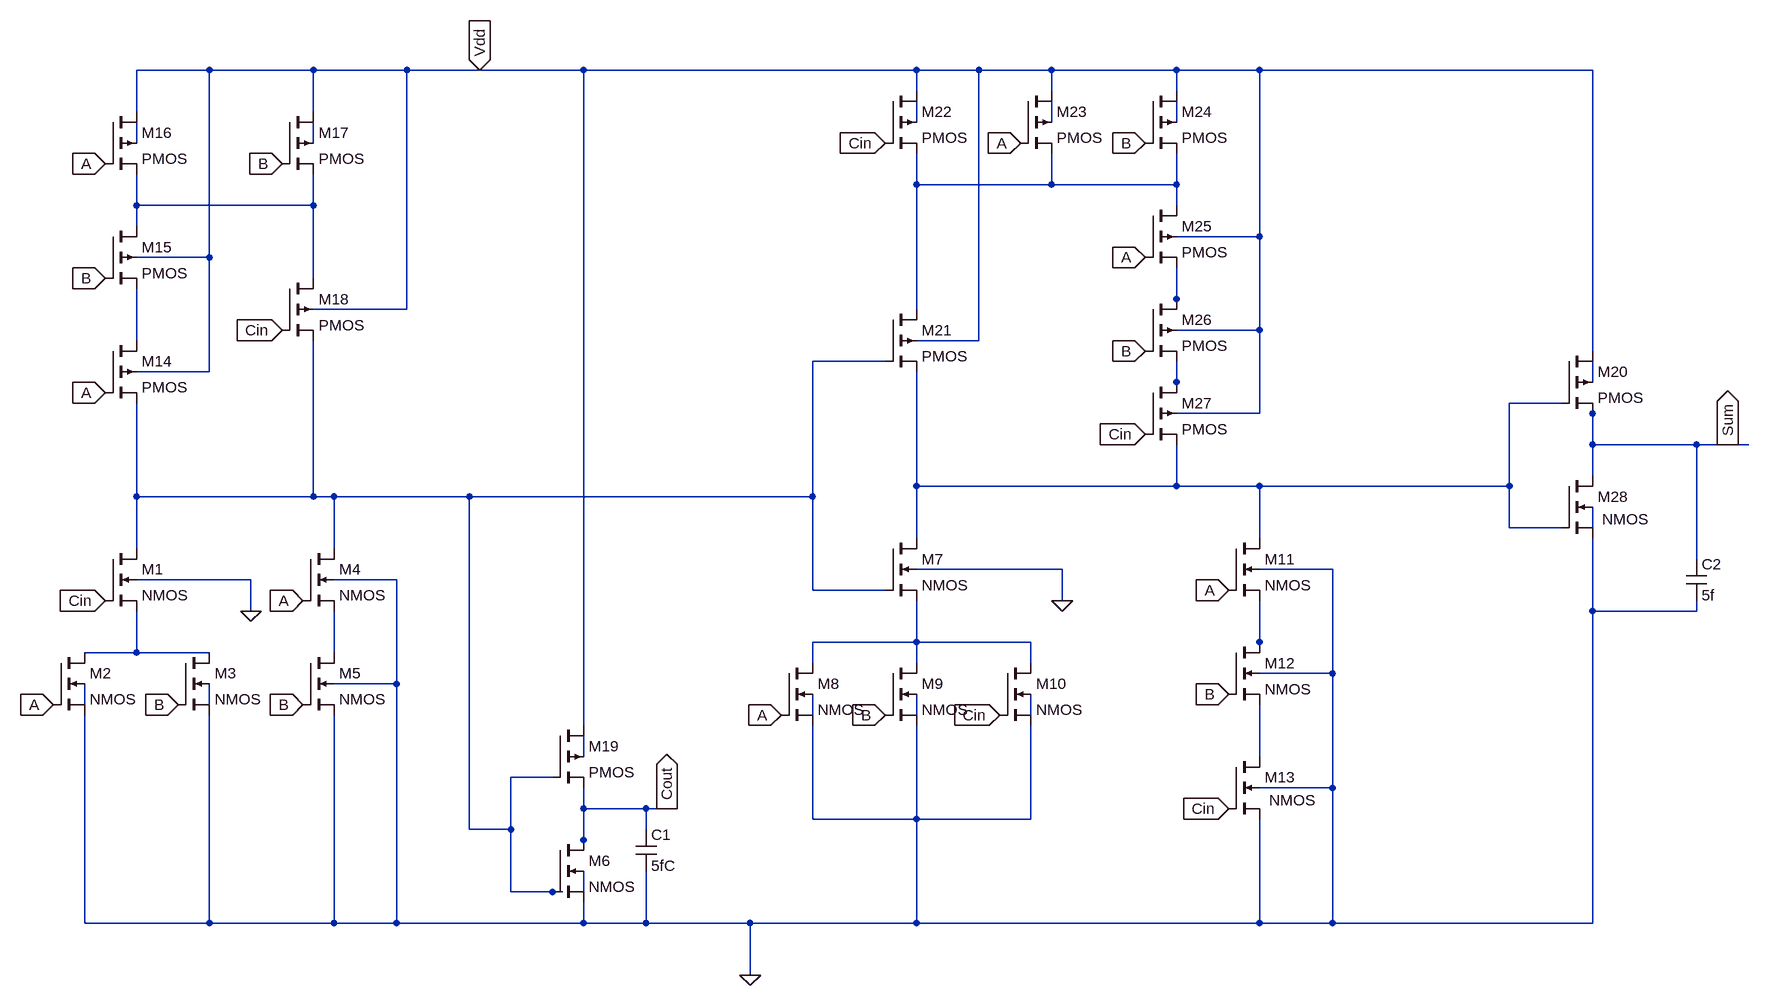
[diagram p0: schematic fa.asc]
fa.asc, the LTspice schematic file:
Version 4.1
SHEET 1 1716 820
WIRE -704 -592 -816 -592
WIRE -544 -592 -704 -592
WIRE -400 -592 -544 -592
WIRE -288 -592 -400 -592
WIRE -128 -592 -288 -592
WIRE 384 -592 -128 -592
WIRE 480 -592 384 -592
WIRE 592 -592 480 -592
WIRE 784 -592 592 -592
WIRE 912 -592 784 -592
WIRE 1424 -592 912 -592
WIRE 384 -560 384 -592
WIRE 592 -560 592 -592
WIRE 784 -560 784 -592
WIRE -816 -528 -816 -592
WIRE -544 -528 -544 -592
WIRE 384 -512 384 -544
WIRE 592 -512 592 -544
WIRE 784 -512 784 -544
WIRE -816 -480 -816 -512
WIRE -544 -480 -544 -512
WIRE 384 -416 384 -464
WIRE 592 -416 592 -464
WIRE 592 -416 384 -416
WIRE 784 -416 784 -464
WIRE 784 -416 592 -416
WIRE -816 -384 -816 -432
WIRE -544 -384 -544 -432
WIRE -544 -384 -816 -384
WIRE 784 -384 784 -416
WIRE -816 -352 -816 -384
WIRE 912 -336 912 -592
WIRE 912 -336 784 -336
WIRE -704 -304 -704 -592
WIRE -704 -304 -816 -304
WIRE -544 -272 -544 -384
WIRE 784 -240 784 -288
WIRE -400 -224 -400 -592
WIRE -400 -224 -544 -224
WIRE 384 -224 384 -416
WIRE 784 -224 784 -240
WIRE 912 -192 912 -336
WIRE 912 -192 784 -192
WIRE -816 -176 -816 -256
WIRE 480 -176 480 -592
WIRE 480 -176 384 -176
WIRE 1424 -160 1424 -592
WIRE 336 -144 224 -144
WIRE -704 -128 -704 -304
WIRE -704 -128 -816 -128
WIRE 784 -112 784 -144
WIRE 1424 -112 1424 -144
WIRE 784 -96 784 -112
WIRE 1376 -80 1296 -80
WIRE 912 -64 912 -192
WIRE 912 -64 784 -64
WIRE 1424 -64 1424 -80
WIRE 1424 -16 1424 -64
WIRE 1584 -16 1424 -16
WIRE 1632 -16 1584 -16
WIRE 1664 -16 1632 -16
WIRE 1424 32 1424 -16
WIRE 384 48 384 -128
WIRE 784 48 784 -16
WIRE 784 48 384 48
WIRE 912 48 784 48
WIRE 1296 48 1296 -80
WIRE 1296 48 912 48
WIRE -816 64 -816 -80
WIRE -544 64 -544 -176
WIRE -544 64 -816 64
WIRE -512 64 -544 64
WIRE -304 64 -512 64
WIRE 224 64 224 -144
WIRE 224 64 -304 64
WIRE 1296 112 1296 48
WIRE 1376 112 1296 112
WIRE 1424 112 1424 80
WIRE 384 128 384 48
WIRE 912 128 912 48
WIRE -816 144 -816 64
WIRE -512 144 -512 64
WIRE 1584 160 1584 -16
WIRE 608 176 384 176
WIRE 1024 176 912 176
WIRE -640 192 -816 192
WIRE -416 192 -512 192
WIRE 224 208 224 64
WIRE 336 208 224 208
WIRE 608 224 608 176
WIRE -640 240 -640 192
WIRE 1424 240 1424 128
WIRE 1584 240 1584 224
WIRE 1584 240 1424 240
WIRE 384 288 384 224
WIRE 384 288 224 288
WIRE 560 288 384 288
WIRE 912 288 912 224
WIRE -816 304 -816 240
WIRE -816 304 -896 304
WIRE -704 304 -816 304
WIRE -512 304 -512 240
WIRE 912 304 912 288
WIRE 224 320 224 288
WIRE 384 320 384 288
WIRE 560 320 560 288
WIRE 1024 336 1024 176
WIRE 1024 336 912 336
WIRE -416 352 -416 192
WIRE -416 352 -512 352
WIRE -896 384 -896 352
WIRE -704 384 -704 352
WIRE 224 400 224 368
WIRE 384 400 384 368
WIRE 560 400 560 368
WIRE -128 416 -128 -592
WIRE -128 464 -128 432
WIRE 912 464 912 384
WIRE -176 496 -240 496
WIRE 1024 512 1024 336
WIRE 1024 512 912 512
WIRE -128 544 -128 512
WIRE -32 544 -128 544
WIRE 0 544 -32 544
WIRE 16 544 0 544
WIRE 224 560 224 416
WIRE 384 560 384 416
WIRE 384 560 224 560
WIRE 560 560 560 416
WIRE 560 560 384 560
WIRE -304 576 -304 64
WIRE -240 576 -240 496
WIRE -240 576 -304 576
WIRE -32 576 -32 544
WIRE -128 592 -128 544
WIRE -128 608 -128 592
WIRE -240 672 -240 576
WIRE -176 672 -240 672
WIRE -160 672 -176 672
WIRE -128 672 -128 640
WIRE -896 720 -896 400
WIRE -704 720 -704 400
WIRE -704 720 -896 720
WIRE -512 720 -512 400
WIRE -512 720 -704 720
WIRE -416 720 -416 352
WIRE -416 720 -512 720
WIRE -128 720 -128 688
WIRE -128 720 -416 720
WIRE -32 720 -32 640
WIRE -32 720 -128 720
WIRE 128 720 -32 720
WIRE 384 720 384 560
WIRE 384 720 128 720
WIRE 912 720 912 560
WIRE 912 720 384 720
WIRE 1024 720 1024 512
WIRE 1024 720 912 720
WIRE 1424 720 1424 240
WIRE 1424 720 1024 720
WIRE 128 800 128 720
FLAG -864 224 Cin
IOPIN -864 224 In
FLAG -592 -192 Cin
IOPIN -592 -192 In
FLAG 512 400 Cin
IOPIN 512 400 In
FLAG 336 -480 Cin
IOPIN 336 -480 In
FLAG 736 -32 Cin
IOPIN 736 -32 In
FLAG 864 544 Cin
IOPIN 864 544 In
FLAG -944 384 A
IOPIN -944 384 In
FLAG -864 -448 A
IOPIN -864 -448 In
FLAG -864 -96 A
IOPIN -864 -96 In
FLAG -560 224 A
IOPIN -560 224 In
FLAG 176 400 A
IOPIN 176 400 In
FLAG 864 208 A
IOPIN 864 208 In
FLAG 736 -304 A
IOPIN 736 -304 In
FLAG 544 -480 A
IOPIN 544 -480 In
FLAG -592 -448 B
IOPIN -592 -448 In
FLAG -864 -272 B
IOPIN -864 -272 In
FLAG -752 384 B
IOPIN -752 384 In
FLAG -560 384 B
IOPIN -560 384 In
FLAG 336 400 B
IOPIN 336 400 In
FLAG 736 -480 B
IOPIN 736 -480 In
FLAG 736 -160 B
IOPIN 736 -160 In
FLAG 864 368 B
IOPIN 864 368 In
FLAG 0 544 Cout
IOPIN 0 544 Out
FLAG 1632 -16 Sum
IOPIN 1632 -16 Out
FLAG 128 800 0
FLAG -640 240 0
FLAG 608 224 0
FLAG -288 -592 Vdd
IOPIN -288 -592 In
SYMBOL nmos4 -864 144 R0
SYMATTR InstName M1
SYMATTR Value2 l=180n w=800n
SYMBOL nmos4 -944 304 R0
SYMATTR InstName M2
SYMATTR Value2 l=180n w=800n
SYMBOL nmos4 -752 304 R0
SYMATTR InstName M3
SYMATTR Value2 l=180n w=800n
SYMBOL nmos4 -560 144 R0
SYMATTR InstName M4
SYMATTR Value2 l=180n w=800n
SYMBOL nmos4 -560 304 R0
SYMATTR InstName M5
SYMATTR Value2 l=180n w=800n
SYMBOL nmos4 -176 592 R0
SYMATTR InstName M6
SYMATTR Value2 l=180n w=400n
SYMBOL nmos4 336 128 R0
SYMATTR InstName M7
SYMATTR Value2 l=180n w=800n
SYMBOL nmos4 176 320 R0
SYMATTR InstName M8
SYMATTR Value2 l=180n w=800n
SYMBOL nmos4 336 320 R0
SYMATTR InstName M9
SYMATTR Value2 l=180n w=800n
SYMBOL nmos4 512 320 R0
SYMATTR InstName M10
SYMATTR Value2 l=180n w=800n
SYMBOL nmos4 864 128 R0
SYMATTR InstName M11
SYMATTR Value2 l=180n w=1200n
SYMBOL nmos4 864 288 R0
SYMATTR InstName M12
SYMATTR Value2 l=180n w=1200n
SYMBOL nmos4 864 464 R0
WINDOW 3 63 67 Left 2
SYMATTR InstName M13
SYMATTR Value2 l=180n w=1200n
SYMBOL pmos4 -864 -176 R0
SYMATTR InstName M14
SYMATTR Value2 l=180n w=1600n
SYMBOL pmos4 -864 -352 R0
SYMATTR InstName M15
SYMATTR Value2 l=180n w=1600n
SYMBOL pmos4 -864 -528 R0
SYMATTR InstName M16
SYMATTR Value2 l=180n w=1600n
SYMBOL pmos4 -592 -528 R0
SYMATTR InstName M17
SYMATTR Value2 l=180n w=1600n
SYMBOL pmos4 -592 -272 R0
SYMATTR InstName M18
SYMATTR Value2 l=180n w=1600n
SYMBOL pmos4 -176 416 R0
SYMATTR InstName M19
SYMATTR Value2 l=180n w=800n
SYMBOL pmos4 1376 -160 R0
SYMATTR InstName M20
SYMATTR Value2 l=180n w=800n
SYMBOL pmos4 336 -224 R0
SYMATTR InstName M21
SYMATTR Value2 l=180n w=3200n
SYMBOL pmos4 336 -560 R0
SYMATTR InstName M22
SYMATTR Value2 l=180n w=3200n
SYMBOL pmos4 544 -560 R0
SYMATTR InstName M23
SYMATTR Value2 l=180n w=3200n
SYMBOL pmos4 736 -560 R0
SYMATTR InstName M24
SYMATTR Value2 l=180n w=3200n
SYMBOL pmos4 736 -384 R0
SYMATTR InstName M25
SYMATTR Value2 l=180n w=3200n
SYMBOL pmos4 736 -240 R0
SYMATTR InstName M26
SYMATTR Value2 l=180n w=3200n
SYMBOL pmos4 736 -112 R0
SYMATTR InstName M27
SYMATTR Value2 l=180n w=3200n
SYMBOL nmos4 1376 32 R0
WINDOW 3 63 67 Left 2
SYMATTR InstName M28
SYMATTR Value2 l=180n w=400n
SYMBOL cap -48 576 R0
SYMATTR InstName C1
SYMATTR Value 5fC
SYMBOL cap 1568 160 R0
SYMATTR InstName C2
SYMATTR Value 5f

The netlist it stands for:
* fa.asc
M1 N010 Cin N017 0 NMOS l=180n w=800n
M2 N017 A 0 N019 NMOS l=180n w=800n
M3 N017 B 0 N020 NMOS l=180n w=800n
M4 N010 A N018 0 NMOS l=180n w=800n
M5 N018 B 0 0 NMOS l=180n w=800n
M6 Cout N010 0 N026 NMOS l=180n w=400n
M7 N013 N010 N015 0 NMOS l=180n w=800n
M8 N015 A 0 N021 NMOS l=180n w=800n
M9 N015 B 0 N022 NMOS l=180n w=800n
M10 N015 Cin 0 N023 NMOS l=180n w=800n
M11 N013 A N016 0 NMOS l=180n w=1200n
M12 N016 B N025 0 NMOS l=180n w=1200n
M13 N025 Cin 0 0 NMOS l=180n w=1200n
M14 N009 A N010 Vdd PMOS l=180n w=1600n
M15 N007 B N009 Vdd PMOS l=180n w=1600n
M16 Vdd A N007 N004 PMOS l=180n w=1600n
M17 Vdd B N007 N005 PMOS l=180n w=1600n
M18 N007 Cin N010 Vdd PMOS l=180n w=1600n
M19 Vdd N010 Cout N024 PMOS l=180n w=800n
M20 Vdd N013 Sum N012 PMOS l=180n w=800n
M21 N006 N010 N013 Vdd PMOS l=180n w=3200n
M22 Vdd Cin N006 N001 PMOS l=180n w=3200n
M23 Vdd A N006 N002 PMOS l=180n w=3200n
M24 Vdd B N006 N003 PMOS l=180n w=3200n
M25 N006 A N008 Vdd PMOS l=180n w=3200n
M26 N008 B N011 Vdd PMOS l=180n w=3200n
M27 N011 Cin N013 Vdd PMOS l=180n w=3200n
M28 Sum N013 0 N014 NMOS l=180n w=400n
C1 Cout 0 5fC
C2 Sum 0 5f
.model NMOS NMOS
.model PMOS PMOS
.lib standard.mos
.backanno
.end